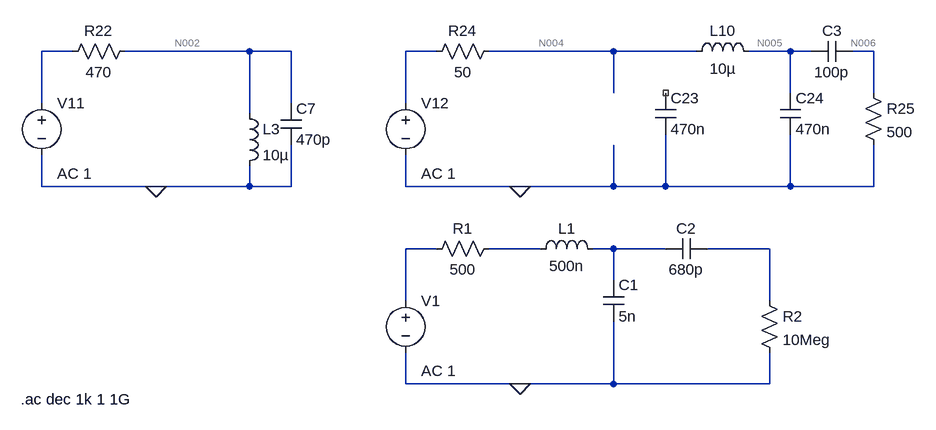
[diagram p0: schematic freq-bpf.asc]
freq-bpf.asc, the LTspice schematic file:
Version 4
SHEET 1 1956 900
WIRE -240 -224 -288 -224
WIRE 32 -224 -160 -224
WIRE 96 -224 32 -224
WIRE 320 -224 272 -224
WIRE 592 -224 400 -224
WIRE 720 -224 592 -224
WIRE 864 -224 800 -224
WIRE 896 -224 864 -224
WIRE 992 -224 960 -224
WIRE 592 -160 592 -224
WIRE 864 -160 864 -224
WIRE 992 -160 992 -224
WIRE -288 -144 -288 -224
WIRE 96 -144 96 -224
WIRE 272 -144 272 -224
WIRE 32 -128 32 -224
WIRE -288 -16 -288 -64
WIRE -112 -16 -288 -16
WIRE 32 -16 32 -48
WIRE 32 -16 -112 -16
WIRE 96 -16 96 -80
WIRE 96 -16 32 -16
WIRE 272 -16 272 -64
WIRE 448 -16 272 -16
WIRE 592 -16 592 -80
WIRE 592 -16 448 -16
WIRE 672 -16 672 -96
WIRE 672 -16 592 -16
WIRE 864 -16 864 -96
WIRE 864 -16 672 -16
WIRE 992 -16 992 -80
WIRE 992 -16 864 -16
WIRE 320 80 272 80
WIRE 480 80 400 80
WIRE 592 80 560 80
WIRE 672 80 592 80
WIRE 832 80 736 80
WIRE 592 128 592 80
WIRE 272 160 272 80
WIRE 832 160 832 80
WIRE 272 288 272 240
WIRE 448 288 272 288
WIRE 592 288 592 192
WIRE 592 288 448 288
WIRE 832 288 832 240
WIRE 832 288 592 288
FLAG -112 -16 0
FLAG 448 -16 0
FLAG 448 288 0
SYMBOL voltage -288 -160 R0
WINDOW 123 24 124 Left 2
WINDOW 39 0 0 Left 0
SYMATTR Value2 AC 1
SYMATTR InstName V11
SYMATTR Value ""
SYMBOL res -256 -208 R270
WINDOW 0 32 56 VTop 2
WINDOW 3 0 56 VBottom 2
SYMATTR InstName R22
SYMATTR Value 470
SYMBOL voltage 272 -160 R0
WINDOW 123 24 124 Left 2
WINDOW 39 0 0 Left 0
SYMATTR Value2 AC 1
SYMATTR InstName V12
SYMATTR Value ""
SYMBOL res 304 -208 R270
WINDOW 0 32 56 VTop 2
WINDOW 3 0 56 VBottom 2
SYMATTR InstName R24
SYMATTR Value 50
SYMBOL res 976 -176 R0
SYMATTR InstName R25
SYMATTR Value 500
SYMBOL cap 656 -160 R0
SYMATTR InstName C23
SYMATTR Value 470n
SYMBOL ind 704 -208 R270
WINDOW 0 32 56 VTop 2
WINDOW 3 5 56 VBottom 2
SYMATTR InstName L10
SYMATTR Value 10µ
SYMBOL cap 848 -160 R0
SYMATTR InstName C24
SYMATTR Value 470n
SYMBOL cap 80 -144 R0
SYMATTR InstName C7
SYMATTR Value 470p
SYMBOL ind 16 -144 R0
SYMATTR InstName L3
SYMATTR Value 10µ
SYMBOL voltage 272 144 R0
WINDOW 123 24 124 Left 2
WINDOW 39 0 0 Left 0
SYMATTR Value2 AC 1
SYMATTR InstName V1
SYMATTR Value ""
SYMBOL res 304 96 R270
WINDOW 0 32 56 VTop 2
WINDOW 3 0 56 VBottom 2
SYMATTR InstName R1
SYMATTR Value 500
SYMBOL cap 576 128 R0
SYMATTR InstName C1
SYMATTR Value 5n
SYMBOL ind 464 96 R270
WINDOW 0 32 56 VTop 2
WINDOW 3 5 56 VBottom 2
SYMATTR InstName L1
SYMATTR Value 500n
SYMBOL cap 736 64 R90
WINDOW 0 0 32 VBottom 2
WINDOW 3 32 32 VTop 2
SYMATTR InstName C2
SYMATTR Value 680p
SYMBOL res 816 144 R0
SYMATTR InstName R2
SYMATTR Value 10Meg
SYMBOL cap 960 -240 R90
WINDOW 0 0 32 VBottom 2
WINDOW 3 32 32 VTop 2
SYMATTR InstName C3
SYMATTR Value 100p
TEXT -320 312 Left 2 !.ac dec 1k 1 1G

The netlist it stands for:
* freq-bpf.asc
V11 N001 0 AC 1
R22 N001 N002 470
V12 N003 0 AC 1
R24 N003 N004 50
R25 N006 0 500
C23 NC_01 0 470n
L10 N004 N005 10µ
C24 N005 0 470n
C7 N002 0 470p
L3 N002 0 10µ
V1 N007 0 AC 1
R1 N007 N008 500
C1 N009 0 5n
L1 N008 N009 500n
C2 N010 N009 680p
R2 N010 0 10Meg
C3 N006 N005 100p
.ac dec 1k 1 1G
.backanno
.end

* Results of the author's LTspice run, read from the files saved beside the schematic
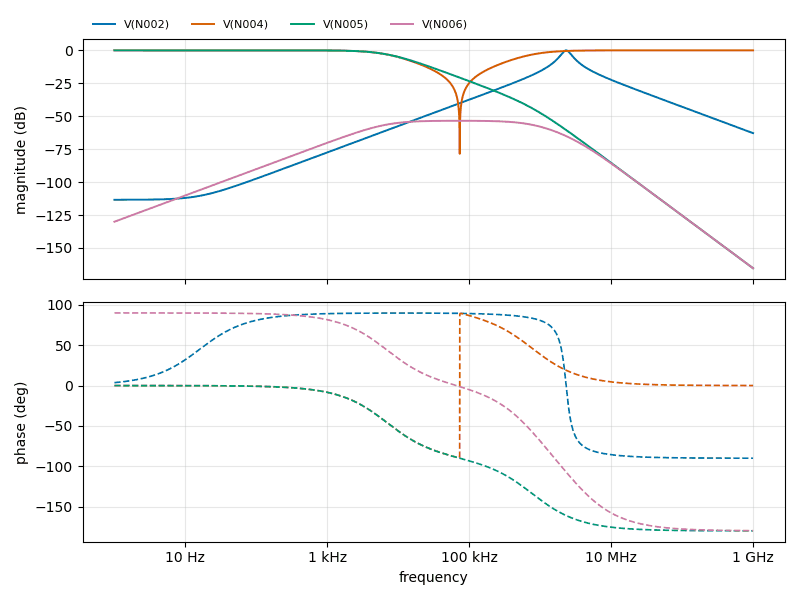
[diagram p1: AC Analysis of freq-bpf.asc, plotted from the saved traces]
* AC Analysis, 1 run:
*   V(N002): -113.42 dB at 1 Hz, -62.85 dB at 1 GHz, peak -0.00 dB at 2.323 MHz, 3 dB below the peak at 1.989 MHz and 2.71 MHz
*   V(N004): -0.00 dB at 1 Hz, -0.00 dB at 1 GHz, peak -0.00 dB at 1 Hz, 3 dB below the peak at 6.714 kHz
*   V(N005): -0.00 dB at 1 Hz, -165.37 dB at 1 GHz, peak -0.00 dB at 1 Hz, 3 dB below the peak at 6.829 kHz
*   V(N006): -130.06 dB at 1 Hz, -165.37 dB at 1 GHz, peak -53.45 dB at 72.28 kHz, 3 dB below the peak at 6.711 kHz and 759.3 kHz